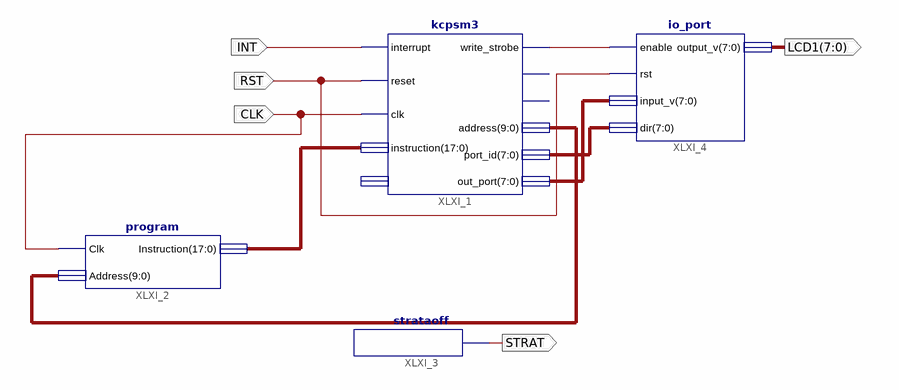
[diagram p0: schematic sheet 1]
// Xilinx ISE schematic todo.sch (spartan3e) as structural Verilog: 4 symbols, 5 ports
module todo (
  input  INT,
  input  RST,
  input  CLK,
  output [7:0] LCD1,
  output STRAT
);

  wire XLXN_10;
  wire [7:0] XLXN_8, XLXN_9;
  wire [9:0] XLXN_7;
  wire [17:0] XLXN_5;

  kcpsm3 XLXI_1 (
    .interrupt(INT), .reset(RST), .clk(CLK), .instruction(XLXN_5), .write_strobe(XLXN_10), .address(XLXN_7),
    .port_id(XLXN_9), .out_port(XLXN_8));  // open: in_port, read_strobe, interrupt_ack
  \program  XLXI_2 (.Clk(CLK), .Address(XLXN_7), .Instruction(XLXN_5));
  strataoff XLXI_3 (.op(STRAT));
  io_port XLXI_4 (.enable(XLXN_10), .rst(RST), .input_v(XLXN_8), .dir(XLXN_9), .output_v(LCD1));
endmodule
